# EAGLE board ACB-Light-R1.0-J05 (EAGLE 6.6.0)
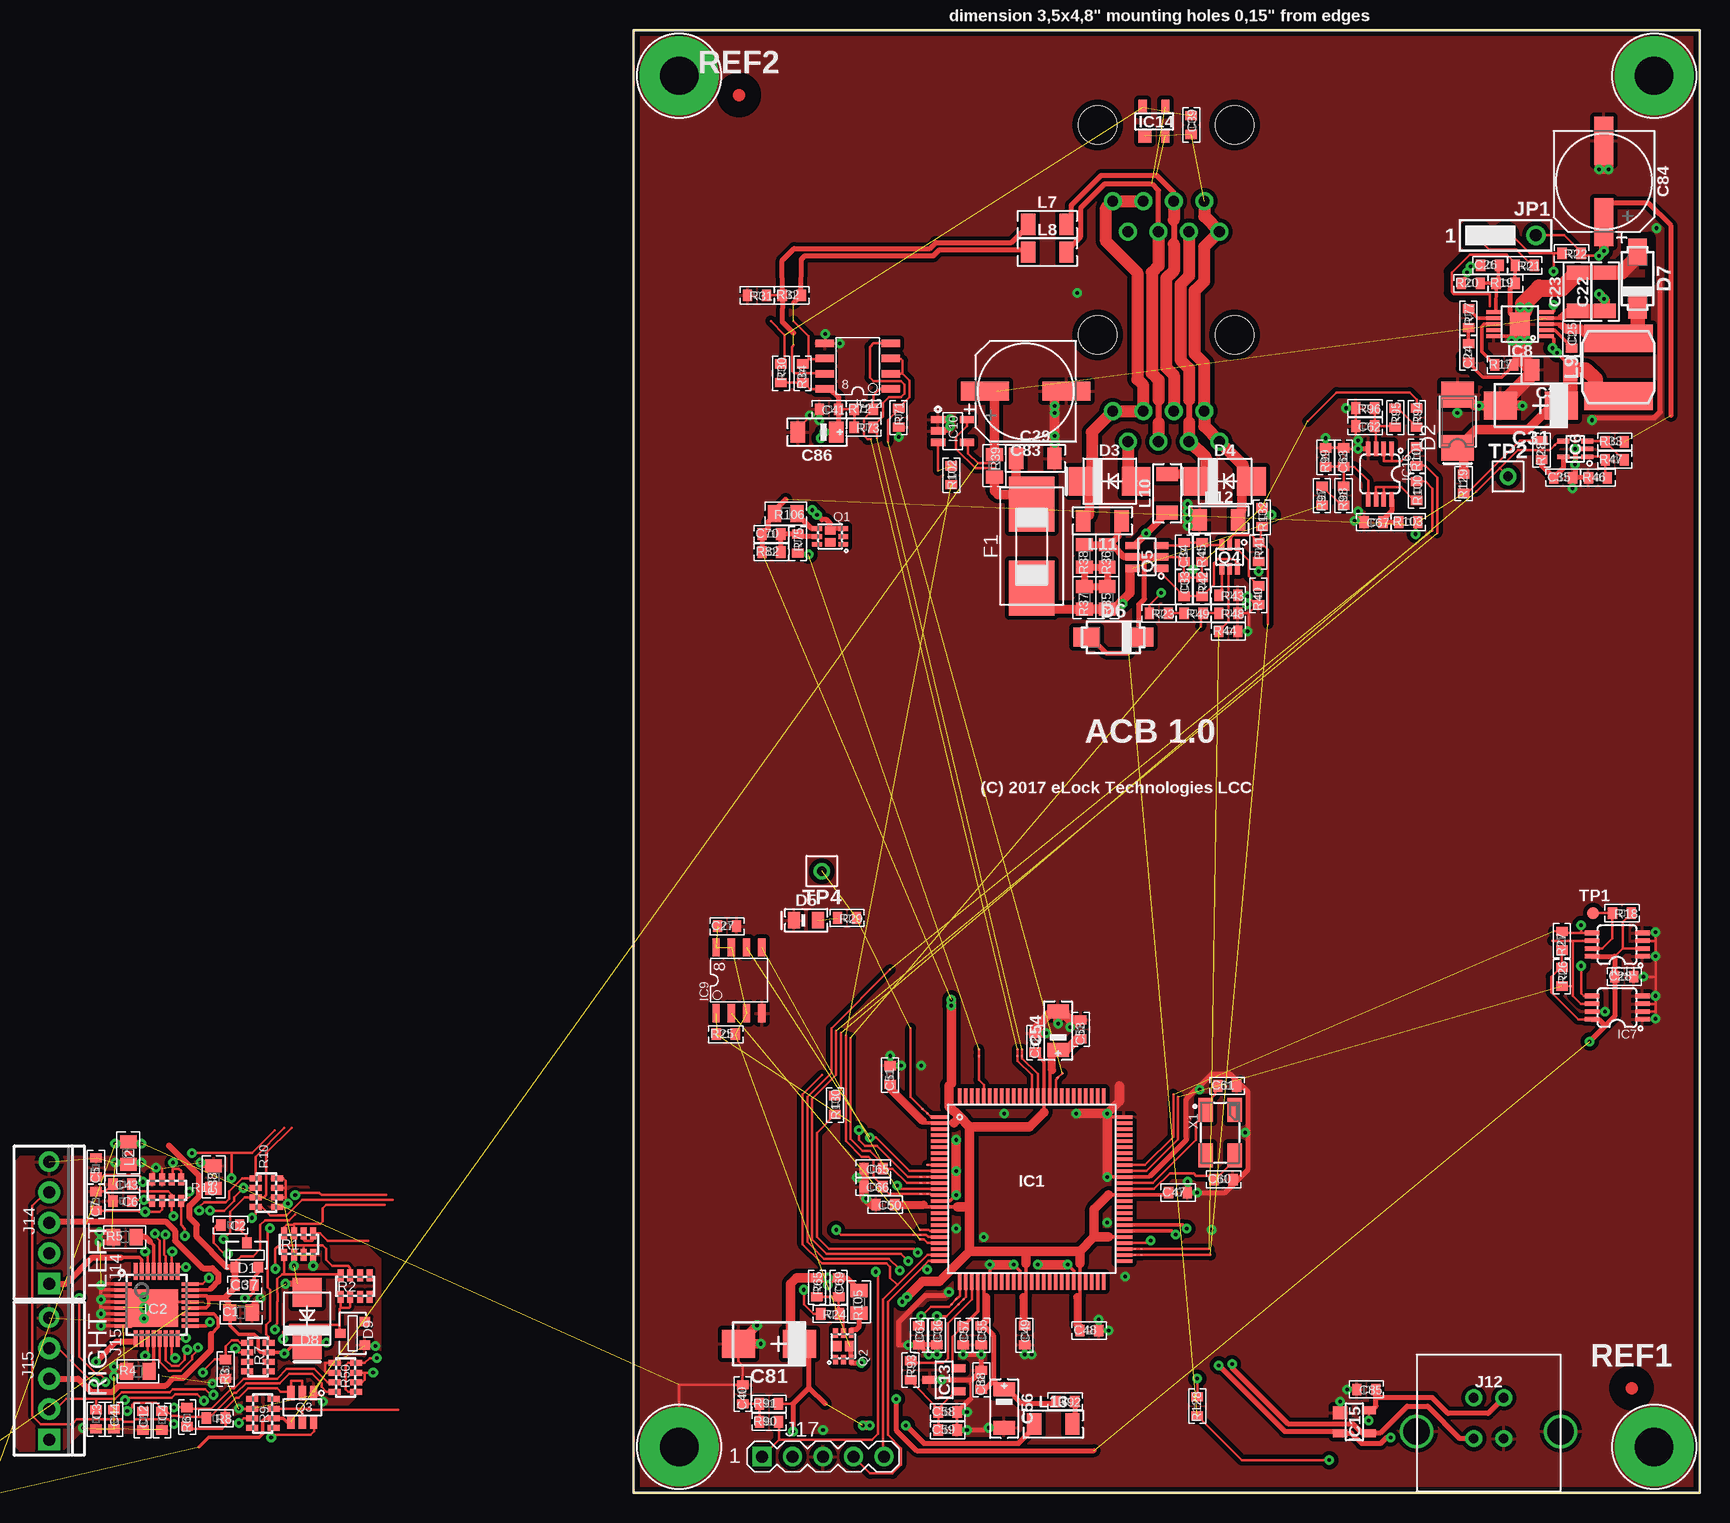
[diagram p6: board, top side]
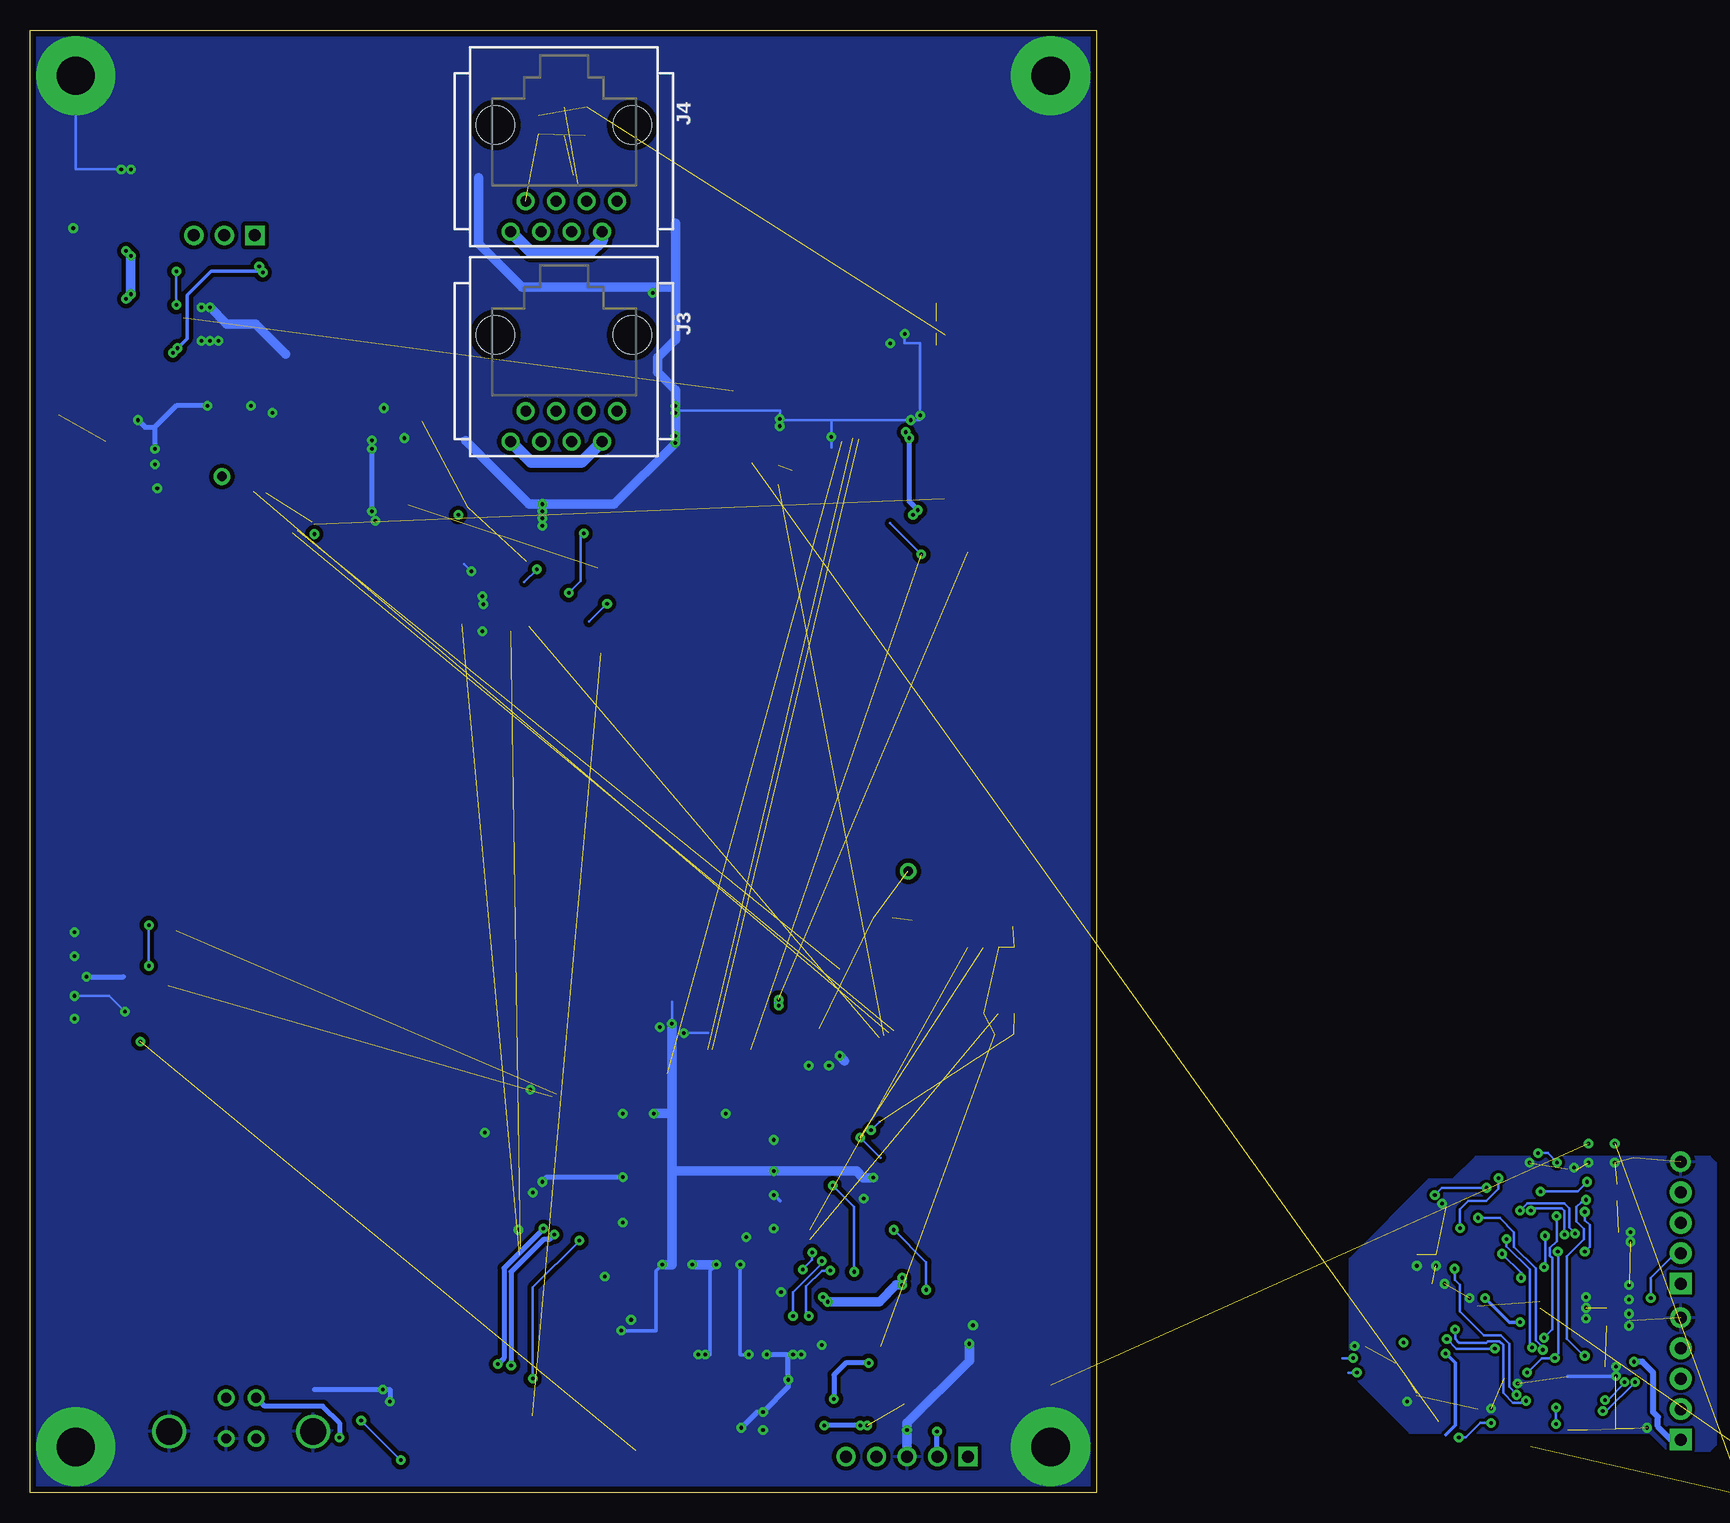
[diagram p7: board, bottom side, seen from below]

Size 88.9 x 121.92 mm. Coordinates in mm from the lower left corner, seen from the top.
Copper layers (1*16): Top 0.035mm / dielectric 1.5mm / Bottom 0.035mm
Design rules "default *": minimum track width 0.2mm, minimum drill 0.3mm, track to track 0.2mm, track to pad 0.2mm, pad to pad 0.2mm, via to via 0.2mm, smd to smd 0.001mm, copper to edge 0.5mm, drill to drill 0.2mm, minimum pad ring 0.3mm, minimum via ring 0.25mm, stop-mask expansion 0.1mm, vias tented up to drill 0.6mm, thermal gap 0.35mm
Net classes: 1 HV: clearance 0.3 mm to class 0
tRestrict: area -41.7,17.1 to -37.9,17.6; 34 lines

## Footprints (pad centres in the part's own frame; a part is rotated, then mirrored left to right if it is on the bottom)
0805 = smd 1.092 x 1.397: 1 -0.94,0; 2 0.94,0
0603 = smd 0.762 x 0.965: 1 -0.787,0; 2 0.787,0
1206 = smd 1.19 x 1.79: 1 -1.6,0; 2 1.6,0
CT-C = smd 2.743 x 2.311: + -2.54,0; - 2.54,0
1206-POL-C = smd 1.19 x 1.79: + -1.6,0; - 1.6,0
CAP_8MM_DIA_SMT = smd 1.59 x 3.99: 1 0,3.4; 2 0,-3.4
SOT-23 = smd 0.787 x 0.889: 1 0.991,1.016; 2 -0.94,1.016; 3 0.025,-1.016
SMA = smd 2.159 x 2.743: + -2.311,0.003; - 2.108,-0.002
SMB = smd 2.4 x 2.4: A 2.2,0; C -2.2,0
0805-POL-D = smd 0.99 x 1.39: A 1,0; K -1,0
SMA' = smd 2.21 x 1.575: A -2.223,0; K 2.223,0
LITTLEFUSE0154 = smd 4.6 x 3.8: 1 3.5,0; 2 -3.5,0
TQFP100_14X14_0,5MM = smd 1.39 x 0.28: 1 -7.7,6; 2 -7.7,5.5; 3 -7.7,5; 4 -7.7,4.5; 5 -7.7,4; 6 -7.7,3.5; 7 -7.7,3; 8 -7.7,2.5; 9 -7.7,2; 10 -7.7,1.5; 11 -7.7,1; 12 -7.7,0.5; 13 -7.7,0; 14 -7.7,-0.5; 15 -7.7,-1; 16 -7.7,-1.5; 17 -7.7,-2; 18 -7.7,-2.5; 19 -7.7,-3; 20 -7.7,-3.5; 21 -7.7,-4; 22 -7.7,-4.5; 23 -7.7,-5; 24 -7.7,-5.5; 25 -7.7,-6; 51 7.7,-6; 52 7.7,-5.5; 53 7.7,-5; 54 7.7,-4.5; 55 7.7,-4; 56 7.7,-3.5; 57 7.7,-3; 58 7.7,-2.5; 59 7.7,-2; 60 7.7,-1.5; 61 7.7,-1; 62 7.7,-0.5; 63 7.7,0; 64 7.7,0.5; 65 7.7,1; 66 7.7,1.5; 67 7.7,2; 68 7.7,2.5; 69 7.7,3; 70 7.7,3.5; 71 7.7,4; 72 7.7,4.5; 73 7.7,5; 74 7.7,5.5; 75 7.7,6 | smd 0.28 x 1.39: 26 -6,-7.7; 27 -5.5,-7.7; 28 -5,-7.7; 29 -4.5,-7.7; 30 -4,-7.7; 31 -3.5,-7.7; 32 -3,-7.7; 33 -2.5,-7.7; 34 -2,-7.7; 35 -1.5,-7.7; 36 -1,-7.7; 37 -0.5,-7.7; 38 0,-7.7; 39 0.5,-7.7; 40 1,-7.7; 41 1.5,-7.7; 42 2,-7.7; 43 2.5,-7.7; 44 3,-7.7; 45 3.5,-7.7; 46 4,-7.7; 47 4.5,-7.7; 48 5,-7.7; 49 5.5,-7.7; 50 6,-7.7; 76 6,7.7; 77 5.5,7.7; 78 5,7.7; 79 4.5,7.7; 80 4,7.7; 81 3.5,7.7; 82 3,7.7; 83 2.5,7.7; 84 2,7.7; 85 1.5,7.7; 86 1,7.7; 87 0.5,7.7; 88 0,7.7; 89 -0.5,7.7; 90 -1,7.7; 91 -1.5,7.7; 92 -2,7.7; 93 -2.5,7.7; 94 -3,7.7; 95 -3.5,7.7; 96 -4,7.7; 97 -4.5,7.7; 98 -5,7.7; 99 -5.5,7.7; 100 -6,7.7
SQFP-S-5X5-32 = smd 0.3 x 1.4: 1 -1.75,-2.8; 2 -1.25,-2.8; 3 -0.75,-2.8; 4 -0.25,-2.8; 5 0.25,-2.8; 6 0.75,-2.8; 7 1.25,-2.8; 8 1.75,-2.8; 17 1.75,2.8; 18 1.25,2.8; 19 0.75,2.8; 20 0.25,2.8; 21 -0.25,2.8; 22 -0.75,2.8; 23 -1.25,2.8; 24 -1.75,2.8 | smd 1.4 x 0.3: 9 2.8,-1.75; 10 2.8,-1.25; 11 2.8,-0.75; 12 2.8,-0.25; 13 2.8,0.25; 14 2.8,0.75; 15 2.8,1.25; 16 2.8,1.75; 25 -2.8,1.75; 26 -2.8,1.25; 27 -2.8,0.75; 28 -2.8,0.25; 29 -2.8,-0.25; 30 -2.8,-0.75; 31 -2.8,-1.25; 32 -2.8,-1.75 | smd 3.1 x 4.3: G 0.25,-0.35
SC-70-5 = smd 0.39 x 0.99: 1 -0.65,-1; 2 0,-1; 3 0.65,-1; 4 0.65,1; 5 -0.65,1
MSOP-08 = smd 0.38 x 1.2: 1 -1,-2.1; 2 -0.35,-2.1; 3 0.3,-2.1; 4 0.95,-2.1; 5 0.95,2.1; 6 0.3,2.1; 7 -0.35,2.1; 8 -1,2.1
MSOP10EXP = smd 0.3 x 1.2: 1 -1,-2.2; 2 -0.5,-2.2; 3 0,-2.2; 4 0.5,-2.2; 5 1,-2.2; 6 1,2.2; 7 0.5,2.2; 8 0,2.2; 9 -0.5,2.2; 10 -1,2.2 | smd 1.88 x 1.68: EP 0,0
SO-08 = smd 0.61 x 1.524: 1 -1.905,-2.743; 2 -0.635,-2.743; 3 0.635,-2.743; 4 1.905,-2.743; 5 1.905,2.743; 6 0.635,2.743; 7 -0.635,2.743; 8 -1.905,2.743
SOT23-5 = smd 0.6 x 1.2: 1 -0.95,-1.206; 2 0,-1.206; 3 0.95,-1.206; 4 0.95,1.206; 5 -0.95,1.206
SO08 = smd 0.61 x 1.524: 1 -1.905,-2.743; 2 -0.635,-2.743; 3 0.635,-2.743; 4 1.905,-2.743; 5 1.905,2.743; 6 0.635,2.743; 7 -0.635,2.743; 8 -1.905,2.743
SOT23 = smd 0.69 x 1.19: 1 0.95,1.2; 2 -0.95,1.2; 3 0,-1.2
SOT-143 = smd 1.09 x 1.19: 1 -0.75,-1.2 | smd 0.69 x 1.19: 2 0.95,-1.2; 3 0.95,1.2; 4 -0.95,1.2
RJ8-8-180 = drill 0.9 pad 1.4: 1 -4.445,6.35; 2 -3.175,8.89; 3 -1.905,6.35; 4 -0.635,8.89; 5 0.635,6.35; 6 1.905,8.89; 7 3.175,6.35; 8 4.445,8.89 | hole 3.2: 5.715,0; -5.715,0
USB_B_180 = drill 0.8 pad 1.4: 1_+5V 1.25,2.8; 2_D- -1.25,2.8; 3_D+ -1.25,-0.6; 4_GND 1.25,-0.6 | drill 2.2 pad 2.8: SH1 -6,0; SH2 6,0
3-641215-5 = drill 1 pad 1.829 square: 1 5.08,0 | drill 1 pad 1.829: 2 2.54,0; 3 0,0; 4 -2.54,0 | drill 1 pad 1.702: 5 -5.08,0
MA05-1 = drill 1 pad 1.6 square: 1 -5.08,0 | drill 1 pad 1.6: 2 -2.54,0; 3 0,0; 4 2.54,0; 5 5.08,0
JP3CLOSE12 = drill 1 pad 1.626 square: 1 -2.54,0 | drill 1 pad 1.626: 2 0,0; 3 2.54,0
0805-0RTOP = smd 1.092 x 1.397: 1 -0.94,0; 2 0.94,0
NR6028 = smd 2.3 x 5.7: 1 2.4,0; 2 -2.4,0
TEMP-PAD = smd 0.2 x 0.2: P$1 0,0
PCB-ACB = drill 3.2 pad 6.6: PAD_GND_1 3.81,118.11; PAD_GND_2 85.09,118.11; PAD_GND_3 3.81,3.81; PAD_GND_4 85.09,3.81
MICRO_FET = smd 0.4 x 0.8: 1 -0.65,-1.1; 2 0,-1.1; 3 0.65,-1.1; 4 0.65,1.1; 5 0,1.1; 6 -0.65,1.1 | smd 0.7 x 0.86: P1 -0.5,0; P2 0.5,0
SSOT-6 = smd 0.6 x 1.2: 1 -0.95,-1.2; 2 0,-1.2; 3 0.95,-1.206; 4 0.95,1.2; 5 0,1.2; 6 -0.95,1.2
SC70-6 = smd 0.39 x 0.99: 1 -0.65,-1; 2 0,-1; 3 0.65,-1; 4 0.65,1; 5 0,1; 6 -0.65,1
0603-ARRAY = smd 0.5 x 1: 1 -1.2,-0.9; 2 -0.4,-0.9; 3 0.4,-0.9; 4 1.2,-0.9; 5 1.2,0.9; 6 0.4,0.9; 7 -0.4,0.9; 8 -1.2,0.9
SMD_ROUND_1MM = smd 1 x 1: P$1 0,0
TH_ROUND_14MM08MM = drill 0.8 pad 1.4: P$1 0,0
7B = smd 2 x 1.2: 1 -1.9,-1.2; 2 1.9,-1.2; 3 1.9,1.2; 4 -1.9,1.2

## Placement (x,y rotation side)
C1  4.7u/16V  [0805]  -32.7,15 0 top  (outside the outline)
C2  10nF  [0603]  -33.6,22.3 180 top  (outside the outline)
C3  10nF  [0603]  -44.8,6.1 270 top  (outside the outline)
C4  10nF  [0603]  -39.3,6 270 top  (outside the outline)
C5  10nF  [0603]  -44.8,27.1 90 top  (outside the outline)
C6  10nF  [0603]  -42.6,24.3 180 top  (outside the outline)
C7  10nF  [0603]  -44.8,24.3 90 top  (outside the outline)
C8  100n  [0603]  -60.6,-6.9 0 top  (outside the outline)
C12  10nF  [0603]  -40.9,6 270 top  (outside the outline)
C22  4u7/50  [1206]  81,100.1 90 top
C23  4u7/50  [1206]  78.7,100.1 90 top
C24  1n  [0603]  69.6,95 90 top
C25  470n/25  [0603]  78.2,96.2 270 top
C26  10p  [0603]  71.4,102.3 0 top
C27  100n  [0603]  7.8,47.2 0 top
C28  100n  [0603]  82.6,43 0 top
C29  4u7/50  [1206]  33.5,86.2 0 top
C30  47u/6.3  [1206]  76.5,93.6 180 top
C31  47uTC  [CT-C]  74.8,90.6 180 top
C33  100n  [0603]  45.9,75.5 270 top
C34  1n  [0603]  45.9,78.4 90 top
C35  100n  [0603]  77.5,84.6 0 top
C36  100n  [0603]  25.3,13.1 270 top
C37  1u/16V  [0603]  -32.4,17.3 0 top  (outside the outline)
C38  4.7u/16V  [0805]  -35,26.3 90 top  (outside the outline)
C39  100n  [0603]  46.5,114 270 top
C40  100n  [0603]  9.1,8.2 90 top
C41  100n  [0603]  16.3,90.3 180 top
C43  10nF  [0603]  -42.6,25.7 180 top  (outside the outline)
C44  10nF  [0603]  -43.3,6.1 270 top  (outside the outline)
C47  100n  [0603]  45.4,25 0 top
C48  1u  [0603]  38,13.5 0 top
C49  100n  [0603]  32.6,13.1 270 top
C50  1u  [0603]  21,24 180 top
C51  100n  [0603]  21.4,34.8 90 top
C52  1u  [0603]  33.5,37.5 90 top
C53  10u  [0603]  37.3,38.6 90 top
C54  10uTA  [1206-POL-C]  35.4,38.5 90 top
C55  100n  [0603]  29,13.1 270 top
C56  10uTA  [1206-POL-C]  30.9,7 270 top
C57  100n->10n  [0603]  27.5,13.1 270 top
C58  100n  [0603]  26.2,6.7 0 top
C59  1u->100n  [0603]  26.2,5.2 0 top
C60  18p  [0603]  49.2,26.1 0 top
C61  18p  [0603]  49.5,33.9 0 top
C62  1n  [0603]  61,88.9 180 top
C63  1n  [0603]  59.2,86.3 90 top
C64  100n  [0603]  23.8,13.1 270 top
C65  1n  [0603]  20,27 180 top
C66  10n  [0603]  20,25.5 180 top
C67  10u  [0603]  61.7,80.9 180 top
C69  1n  [0603]  17.1,17.1 270 top
C70  1n  [0603]  11.5,79.9 0 top
C81  47uTC  [CT-C]  11.3,12.4 180 top
C83  220u/25V  [CAP_8MM_DIA_SMT]  32.7,91.8 90 top
C84  220u/25V  [CAP_8MM_DIA_SMT]  80.9,109.3 180 top
C85  100n  [0603]  61.1,8.6 180 top
C86  10uTA  [1206-POL-C]  15.3,88.4 180 top
C88  10u  [0603]  29,9.4 90 top
D1  BAT54S  [SOT-23]  -32.2,19.8 180 top  (outside the outline)
D2  SMLVT3V3  [SMA]  68.7,89.4 90 top
D3  P6SMB20A  [SMB]  39.7,84.3 0 top
D4  P6SMB20A  [SMB]  49.3,84.3 0 top
D5  LED-GREEN  [0805-POL-D]  14.4,47.7 0 top
D6  SS14  [SMA']  40,71.3 0 top
D7  SS14  [SMA']  83.7,101.2 270 top
D8  P6SMB16A  [SMB]  -27.2,14.5 90 top  (outside the outline)
D9  BZX84C6V2  [SOT-23]  -23.4,13.3 270 top  (outside the outline)
F1  T1A-LITTLEFUSE0154  [LITTLEFUSE0154]  33.2,78.9 90 top
IC1  PIC32MX470F512L-I/PF  [TQFP100_14X14_0,5MM]  33.2,25.3 0 top
IC2  L6227Q  [SQFP-S-5X5-32]  -39.74,15.63 270 top  (outside the outline)
IC6  MIC841LYC  [SC-70-5]  78.5,87 90 top
IC7  24LC32A-I/MS  [MSOP-08]  82,40.45 90 top
IC8  LT3971EMSE  [MSOP10EXP]  73.9,97.4 90 top
IC9  AT25SF321-SSHD  [SO-08]  8.8,42.7 0 top
IC10  MAX9938HEUK+T  [SOT23-5]  26.6,88.5 270 top
IC11  24LC32A-I/MS  [MSOP-08]  82,45.7 90 top
IC12  SN65HVD12D  [SO08]  18.7,93.9 90 top
IC13  REF3025  [SOT23]  25.9,9.4 270 top
IC14  TPD2E001DZDR  [SOT-143]  43.4,114.3 0 top
IC15  TPD2E001DZDR  [SOT-143]  60.1,5.9 270 top
IC16  MCP6042-I/MS  [MSOP-08]  62.2,84.9 180 top
J3  RJ8-8-180  [RJ8-8-180]  44.4,96.5 180 bottom
J4  RJ8-8-180  [RJ8-8-180]  44.4,114 180 bottom
J12  USB_A_180  [USB_B_180]  71.3,5.1 0 top
J14  3-641215-5  [3-641215-5]  -48.7,22.5 270 top  (outside the outline)
J15  3-641215-5  [3-641215-5]  -48.7,9.5 270 top  (outside the outline)
J17  DNP-open-hole  [MA05-1]  15.8,3 0 top
JP1  JP3CLOSE12  [JP3CLOSE12]  72.7,104.8 0 top
L2  DNP  [0805-0RTOP]  -42.1,28.3 90 top  (outside the outline)
L7  HI1206T500R  [1206]  34.5,105.7 0 top
L8  HI1206T500R  [1206]  34.5,103.4 0 top
L9  NR6028T4R7M  [NR6028]  82.1,93.8 90 top
L10  HI1206T500R  [1206]  44.5,83.3 90 top
L11  HI1206T500R  [1206]  39.1,81 180 top
L12  HI1206T500R  [1206]  48.8,81.1 0 top
L13  LQM31PN3R3M00L  [1206]  35,5.7 0 top
O1  PIC-OUT  [TEMP-PAD]  24.5,31.6 0 top
O5  PIC-RPX  [TEMP-PAD]  24.5,27.3 0 top
O6  PIC-RPX  [TEMP-PAD]  24.5,26.3 0 top
O7  PIC-RPX  [TEMP-PAD]  24.5,25.8 0 top
O8  PIC-RPX  [TEMP-PAD]  24.5,24.9 0 top
O12  PIC-RPX  [TEMP-PAD]  23.9,21.9 0 top
O13  PIC-RPX  [TEMP-PAD]  23.9,21.1 0 top
O15  PIC-RPX  [TEMP-PAD]  26.9,16.1 90 top
O16  PIC-RPX  [TEMP-PAD]  27.5,16.1 0 top
O23  PIC-OUT  [TEMP-PAD]  28.8,36.4 0 top
O29  PIC-RPX  [TEMP-PAD]  32,36.4 0 top
O30  PIC-RPX  [TEMP-PAD]  32.4,36.4 0 top
O31  PIC-OUT  [TEMP-PAD]  35.4,34.6 0 top
O41  PIC-RPX  [TEMP-PAD]  42.35,20.3 180 top
O42  PIC-RPX  [TEMP-PAD]  41.8,19.8 180 top
O44  PIC-OUT  [TEMP-PAD]  23.9,21.5 0 top
PCB1  PCB-ACB  [PCB-ACB]  0,0 0 top
Q1  SSM6P49NU,LFPZ  [MICRO_FET]  16.4,79.7 90 top
Q2  SSM6P49NU,LFPZ  [MICRO_FET]  17.5,12.2 0 top
Q3  FDC6330L  [SSOT-6]  -27.6,7.1 180 top  (outside the outline)
Q4  FDG6303N  [SC70-6]  49.7,78 180 top
Q5  FDC6506P  [SSOT-6]  42.8,78 90 top
Q6  FDG6303N  [SC70-6]  -57.6,-2.7 0 top  (outside the outline)
Q7  FDC6506P  [SSOT-6]  -60.7,-3 0 top  (outside the outline)
R1  100K  [0603-ARRAY]  -27.9,20.7 0 top  (outside the outline)
R2  33K  [0603-ARRAY]  -23.2,17.2 0 top  (outside the outline)
R3  300R  [0603]  -34,10.3 90 top  (outside the outline)
R4  0.12R  [0805]  -41.3,10.1 0 top  (outside the outline)
R5  0.12R  [0805]  -42.4,21.3 0 top  (outside the outline)
R6  649R  [0603]  -37.2,6.3 90 top  (outside the outline)
R7  3.3K  [0603-ARRAY]  -31.3,11.3 90 top  (outside the outline)
R8  649R  [0603]  -34.8,6.2 180 top  (outside the outline)
R9  100K  [0603-ARRAY]  -30.9,6.6 270 top  (outside the outline)
R10  1M  [0603-ARRAY]  -30.6,25 90 top  (outside the outline)
R11  10K  [0603-ARRAY]  -38.9,25.2 0 top  (outside the outline)
R12  1M  [0603]  -57.1,-6.9 0 top  (outside the outline)
R13  1M  [0603]  -60.6,-9.9 0 top  (outside the outline)
R14  300k  [0603]  -57.1,-9.9 0 top  (outside the outline)
R17  47k  [0603]  72.6,94 0 top
R18  10k  [0603]  82.4,48.3 180 top
R19  560k  [0603]  72.7,100.8 0 top
R20  1M  [0603]  69.8,100.8 0 top
R21  1M  [0603]  74.3,102.3 180 top
R22  4M99  [0603]  78.2,103.3 180 top
R23  1M  [0603]  43.8,73.3 180 top
R24  100k  [0603]  16.4,14.9 180 top
R25  1M  [0603]  7.7,38.2 0 top
R26  10k  [0603]  77.4,43 270 top
R27  10k  [0603]  77.4,46 90 top
R28  100R  [0603]  75.7,86.9 90 top
R29  300R  [0603]  17.8,47.9 180 top
R30  10k  [0603]  12.3,93.3 270 top
R31  1M  [0603]  10.3,99.8 180 top
R32  1M  [0603]  13.2,99.8 0 top
R33  4M99  [0603]  81.8,87.6 0 top
R34  1M  [0603]  14.1,93.3 90 top
R35  1k  [0805]  39.5,74.6 90 top
R36  1k  [0805]  39.5,78.1 90 top
R37  1k  [0805]  37.6,74.6 90 top
R38  1k  [0805]  37.6,78.1 90 top
R39  0.025R  [0805]  30.1,85.6 270 top
R40  300k  [0603]  52.1,74.8 90 top
R41  1M  [0603]  52.1,78.4 270 top
R42  1M  [0603]  47.4,75.5 270 top
R43  300k  [0603]  49.6,74.8 180 top
R44  1M  [0603]  49.6,71.8 0 top
R45  1M  [0603]  47.4,78.4 90 top
R46  560k->750k  [0603]  80.4,84.6 0 top
R47  100k->180k  [0603]  81.8,86.1 0 top
R48  1M  [0603]  49.6,73.3 180 top
R49  560k  [0603]  46.7,73.3 180 top
R50  100K  [0603-ARRAY]  -24,9.6 90 top  (outside the outline)
R65  1M  [0603]  15.3,17.1 270 top
R71  10k  [0603]  22.1,89.6 270 top
R72  1M  [0603]  19.2,90.3 0 top
R73  1M  [0603]  19.2,88.8 180 top
R75  100k  [0603]  13.7,79.1 270 top
R77  47k  [0603]  69.6,97.9 270 top
R82  1M  [0603]  11.5,78.4 0 top
R90  1k  [0603]  11.3,5.9 0 top
R91  10k  [0603]  11.3,7.4 0 top
R92  10R  [0603]  36,7.6 180 top
R93  300R  [0603]  23.1,10.2 270 top
R94  180k  [0603]  65.3,89.6 270 top
R95  4M99  [0603]  63.5,89.6 270 top
R96  560k  [0603]  61,90.4 180 top
R97  180k  [0603]  57.4,83.1 90 top
R98  4M99  [0603]  59.2,83.1 90 top
R99  560k  [0603]  57.7,86.3 90 top
R100  2k2  [0603]  65.3,83.5 270 top
R101  2k2  [0603]  65.3,86.4 90 top
R102  1k  [0603]  26.5,84.8 270 top
R103  300R  [0603]  64.6,80.9 0 top
R105  1R  [0805]  18.8,15.9 90 top
R106  1R  [0805]  12.7,81.6 180 top
R128  10k  [0603]  47,7.2 90 top
R129  DNP/0R  [0603]  69.2,84.1 90 top
R130  100k  [0603]  16.8,32.3 270 top
R132  1M  [0603]  52.4,81.3 270 top
REF1  REF  [REF]  83.2,8.7 0 top
REF2  REF  [REF]  8.8,116.5 0 top
T1  PIC-OUT  [TEMP-PAD]  -61.5,-12 0 top  (outside the outline)
T3  PIC-RPX  [TEMP-PAD]  23.95,25.8 180 top
T5  PIC-OUT  [TEMP-PAD]  42.35,19.8 180 top
T7  PIC-OUT  [TEMP-PAD]  41.8,20.3 180 top
T13  PIC-RPX  [TEMP-PAD]  32,36.95 0 top
T14  PIC-RPX  [TEMP-PAD]  32.4,36.95 270 top
T15  PIC-OUT  [TEMP-PAD]  35.75,34.95 270 top
T27  PIC-OUT  [TEMP-PAD]  23.95,26.3 270 top
T32  PIC-OUT  [TEMP-PAD]  23.35,21.5 270 top
T33  PIC-OUT  [TEMP-PAD]  28.8,36.95 270 top
T36  PIC-OUT  [TEMP-PAD]  24.1,32 0 top
T37  PIN-AN  [TEMP-PAD]  26.5,15.7 0 top
T38  PIN-AN  [TEMP-PAD]  27.1,15.7 270 top
T39  PIN-AN  [TEMP-PAD]  23.95,24.9 270 top
T45  PIC-RPX  [TEMP-PAD]  76.8,87.3 180 top
TP1  DNP-TestPoint  [SMD_ROUND_1MM]  80,48.3 0 top
TP2  DNP-TestPoint  [TH_ROUND_14MM08MM]  72.9,84.7 0 top
TP4  DNP-TestPoint  [TH_ROUND_14MM08MM]  15.7,51.8 180 top
X1  8MHz-5x3.2mm  [7B]  48.9,30 270 top

## Tracks (layer width: path | path; a pad name or v marks a point on that pad's centre or on a via)
+3,3V-FILT
  Top 0.4: R28.1 75.7,85.6 C35.1 77.5,85.4 IC6.5
+3.3V  (via drill 0.3 pad 0.7, 0.3 pad 0.8)  (4 unrouted)
  Top 0.2: R105.2 19,16.9 | 13.3,7.4 R91.2 | R129.1 69.3,83.4 69.6,83.4 73.9,87.7 R28.2 | R103.2 65.2,80.7 v65.2,79.9
  Top 0.28: C47.1 44.8,24.8 IC1.62 39.6,24.8 | 24.1,31 24.1,30.8 IC1.2 26.7,30.8 | 24.2,24 24.2,23.8 IC1.16 27,23.8 | 32.5,16.3 32.7,16.3 IC1.37 32.7,19.1 | 32.5,14.3 32.5,13.9 C49.1 | 37,16.3 37.2,16.3 IC1.46 37.2,19.1 | IC1.55 39.6,21.3 | C52.1 33.5,36.6 34.2,35.9 IC1.86 34.2,31.7
  Top 0.3: C69.1 17,17.9
  Top 0.4: R82.1 C70.1 11.2,80.4 11.2,80.9 11.7,81.4 R106.2 11.7,81.8 12.7,82.8 | v16.2,17.9 C69.1 17.8,17.9 R105.2 | 14.65,8.75 16,7.4 | v13.3,5.1 13.3,7.4 14.65,8.75 | 14.65,8.75 14.65,11.59 C81.+ | v22.7,5.6 24.2,4.1 32.1,4.1 33.4,5.4 L13.1
  Top 0.68: C51.1 21.4,33.7 24.1,31 | C50.1 24.2,24 | 32.5,16.3 32.5,14.3 | 37,16.3 37,14 37.2,13.8 C48.1
  Top 0.8: R28.2 75.6,87.7 | C81.+ 13.1,12.4 13.1,17.4 13.6,17.9 R65.1 v16.2,17.9 v16.2,17.3 | 27.2,31.3 26.3,32.2 26.3,33.9 26.5,34.1 v26.5,40.6 v26.5,41.1 | 26.7,30.8 27.2,31.3 | 27.2,31.3 28,30.5 | 28,30.5 28,23.8 | 28,23.8 28,20.1 | 28,20.1 25.5,17.6 24.1,17.6 v22.8,16.3 | 28,30.5 33,30.5 34.2,31.7 | 28,20.1 32.9,20.1 | 32.9,20.1 37.2,20.1 | 37.2,20.1 38.4,21.3 | 38.4,21.3 38.4,23.6 39.6,24.8 | 38.4,21.3 39.6,21.3 | 37.2,20.1 37.2,19.1 | 32.7,19.1 32.7,19.9 32.9,20.1 | 27,23.8 28,23.8 | 19.3,5.6 v19.1,5.6 v19.7,5.6
  Bottom 0.4: J17.2 13.3,3.04 v13.3,5.1 | v19.7,5.6 v22.7,5.6
  Bottom 0.8: v26.5,41.1 v26.5,40.6 | v22.8,16.3 v22.4,15.9 18.1,15.9 16.7,17.3 v16.2,17.3 v16.2,17.9
+3.3V/1  (via drill 0.3 pad 0.7, 0.3 pad 0.8)  (6 unrouted)
  Top 0.2: R26.1 77.4,43.9 | R27.1 77.4,43.9 | 77.4,43.9 76.5,43 76.5,41.7 78.75,39.45 IC7.8 | IC11.2 82.45,45.35 | 82.45,45.35 81.8,44.7 | R18.1 82.45,47.55 82.45,45.35 | 80.75,38.55 80.75,38.65
  Top 0.4: v21.9,7.8 21.9,5.2 23.6,3.5 38.4,3.5 | Q2.P2 18.15,12.2 Q2.3 18.15,10.8 v19,10.8 | IC11.8 81.8,44.7 C28.1 81.8,39.7 81,38.9 | 81,38.9 80.75,38.65 v79.7,37.6 | IC7.8 80.45,39.45 81,38.9
  Bottom 0.4: v19,10.8 20.9,10.8 21.9,9.8 v21.9,7.8
+3.3V/2  (via drill 0.3 pad 0.8)
  Top 0.2: C41.1 R72.1 R73.2 | R30.2 R34.1 14.2,92.5 14.71,92 IC12.8
  Top 0.3: 16.55,80.35 Q1.P2
  Top 0.4: Q1.3 16.55,80.35 | Q1.P2 16.4,80.8 16.1,81.1 15.7,81.1 v15.3,81.5 v14.9,81.9 | v15.6,87.9 15.6,88.1 v15.9,88.4 C86.+ 17.1,88.6 C41.1 17.1,91.3 16.41,92 IC12.8
  Bottom 0.4: v14.9,81.9 15.6,82.6 v15.6,87.9
/3.3V1PWRON  (via drill 0.3 pad 0.7)
  Top 0.2: v14.2,16.9 14.2,15.7 15,14.9 R24.2 | IC1.21 24.6,21.3 24.4,21.5 O44.P$1 T32.P$1 17.3,21.5 v16.9,21.9
  Bottom 0.2: v14.2,16.9 14.2,19.2 v16.9,21.9
/3.3V2PWRON  (via drill 0.3 pad 0.8)  (1 unrouted)
  Top 0.2: R75.2 13.8,78.2 v14.6,78.2 | IC1.96 29.2,34 28.8,34.4 O23.P$1 T33.P$1
  Bottom 0.2: v14.6,78.2 17.2,80.8
/FMEM1-CS  (via drill 0.3 pad 0.7)  (2 unrouted)
  Top 0.2: IC1.11 O6.P$1 T27.P$1 22.9,26.3 20.3,28.9 19.3,28.9 18.8,29.4 v18.8,30.2
  Bottom 0.2: 18.1,30.9 v18.8,30.2
/MCLR  (via drill 0.3 pad 0.7)
  Top 0.2: IC1.13 22.3,25.3 v22,25.6 | 12.12,4.4 19.9,4.4 20.4,4.9 20.4,18.2 v20.2,18.4 | 12.12,4.4 J17.1 | 12.12,4.4 12.12,5.88 R90.2
  Bottom 0.2: v20.2,18.4 20.2,23.8 v22,25.6
A+  (1 unrouted)
  Top 0.4: L8.2 36.1,103.5 37.3,104.7 37.3,107.1 39.3,109.1 43.2,109.1 43.77,108.53 J4.4
  Top 0.5: 43.77,91.1 43.77,89.17
  Top 1: J4.4 43.77,102.27 43.2,101.7 43.2,93.3 43.77,92.73 43.77,91.1 | 43.77,89.17 J3.4
A++  (1 unrouted)
  Top 0.2: R34.2 14.2,94.1 14.6,94.5 | 14.6,94.5 15.92,94.5 IC12.6 | 13.35,97.65 14.6,96.4 14.6,94.5
  Top 0.4: 13.35,99.15 R32.2 14,102.8 14.3,103.1 25,103.1 25.5,103.6 32.7,103.6 L8.1
ACT-L-SENSE
  Top 0.2: R1.8 -29.1,22.1 -28.9,22.3 -28.4,22.3 | -28.4,22.3 -28.3,22.4 -26.1,22.4 -25.9,22.6 -25.9,23.7 -25.6,24 -20.72,24 | R1.7 -28.3,22.2 -28.4,22.3
ACT-L-SW  (via drill 0.3 pad 0.7)
  Top 0.2: v-46.2,16.2 -46.2,11.3 -44.7,9.8 -44.4,9.8 -44,9.4 v-44,9.2 | R2.8 -24.5,18.2 -29.1,18.2 | -29.1,18.2 R1.1 | -29.1,18.2 -29.3,18.2 -29.7,17.8 -29.7,16.65 -29.65,16.6 -29.65,15.95 -29.7,15.9 -29.7,14.1 -29.9,13.9 v-29.9,13.6 | v-35.8,7.65 -36.35,8.2 -38.2,8.2 -38.5,7.9 -42.2,7.9 v-42.4,7.7 -42.6,7.7 -43.3,7 C44.1
  Bottom 0.2: J14.2 -48.26,19.96 -46.2,17.9 v-46.2,16.2 | v-42.4,7.7 -42.6,7.7 -44,9.1 v-44,9.2 | v-29.9,13.6 -29.9,12.8 -30.2,12.5 -32.5,12.5 -32.6,12.6 -32.62,12.6 -32.64,12.62 -33.58,12.62 -33.9,12.3 -33.9,8.3 -34.7,7.5 -35.65,7.5 v-35.8,7.65
ACT-R-SENSE
  Top 0.2: R1.6 -27.5,21.1 -27.4,21 -26.8,21 -26.7,21.1 R1.5 -26.1,21.6 -25.5,21 -22.1,21
ACT-R-SW  (via drill 0.3 pad 0.7)
  Top 0.2: J15.2 -48.14,6.96 -47.3,7.8 -44.8,7.8 | -27.5,20.6 -25.9,20.6 -25.6,20.3 -25.6,19.4 -25.1,18.9 -23.8,18.9 -23.6,18.7 R2.7 | -27.5,20.6 R1.3 | -27.5,20.6 -29.55,20.6 -29.85,20.3 v-29.85,18.65 | -44.8,7.8 -43.2,7.8 -42.65,8.35 -38.65,8.35 -38.4,8.6 -35.7,8.6 -35.3,8.2 -35.05,8.2 v-35,8.15 | C3.1 -44.8,7.8
  Bottom 0.2: v-29.85,18.65 -29.85,17.75 -30.3,17.3 -30.3,15.1 -32.3,13.1 -33.7,13.1 -34.4,12.4 -34.4,8.8 -35,8.2 v-35,8.15
ACT_EN  (via drill 0.3 pad 0.7)
  Top 0.2: -29.9,30.2 -31.8,28.3 -33.5,28.3 | -33.5,28.3 v-36.8,28.3 | -38.4,26.9 -38.4,26.2 R11.6 | v-38.4,27.5 -38.4,26.9 | R11.5 -37.7,26.8 -37.9,27 -38.3,27 -38.4,26.9 | v-30.3,22.05 -30.5,21.85 -30.5,17.1 -30.3,16.9 -30.3,14.3 -30.6,14 -30.6,13.2 -30.4,13 R7.4 | v-33.5,26.2 -33.5,28.3
  Bottom 0.2: v-36.8,28.3 -37.6,28.3 v-38.4,27.5 | v-30.3,22.05 -30.3,23.6 -31,24.3 -32.5,24.3 -33.5,25.3 v-33.5,26.2
ACT_L1  (via drill 0.3 pad 0.7)
  Top 0.2: IC2.27 -38.99,19.69 -39.1,19.8 -39.1,21.4 v-39,21.5 | v-36.2,23.5 -36.2,23.8 -35.8,24.2 -34,24.2 -33.7,24.5 -33.7,25.1 -32.6,26.2 R10.5 -31.5,28 -29.1,30.4
  Bottom 0.2: v-39,21.5 -39,23.5 -38.8,23.7 -36.4,23.7 v-36.2,23.5
ACT_L2  (via drill 0.3 pad 0.7)
  Top 0.2: IC2.28 -39.49,19.29 -39.5,19.3 -39.5,21 -39.9,21.4 v-39.9,21.6 | v-35.3,23.5 -34.1,23.5 -33.3,24.3 -33.3,24.6 v-32.5,25.4 R10.6 | -20.6,24.8 -26,24.8 -26.2,25 -28,25 v-28.2,24.8
  Bottom 0.2: v-39.9,21.6 -39.4,22.1 -39.4,23.7 -39,24.1 -36.46,24.1 -36.44,24.12 -35.92,24.12 v-35.3,23.5 | v-32.5,25.4 -28.8,25.4 v-28.2,24.8
ACT_L+
  Top 0.3: IC2.31 -40.99,19.39 -41.2,19.6 -42.7,19.6
  Top 0.5: -42.7,19.6 -45.1,19.6 -47.3,17.4 -48.68,17.4 J14.1
ACT_L-
  Top 0.3: IC2.23 -35.32,16.88 -35.2,17
  Top 0.5: -35.2,17 -34.6,17.6 -34.6,18.2 -35.1,18.7 -35.9,18.7 -38.2,21 -38.2,21.8 -39,22.6 -48.6,22.6 J14.3
ACT_R1  (via drill 0.3 pad 0.7)
  Top 0.2: IC2.13 -39.49,10.89 -38.75,10.15 -37.75,10.15 -36.8,11.1 -36.8,11.4 -36.3,11.9 v-36.3,12.1 | v-34.18,21.12 -33.6,21.7 -33.6,23.4 -32.4,24.6 R10.7 -30.8,24.6 -30.6,24.8 -30.6,28.3 -28.5,30.4
  Bottom 0.2: v-36.3,12.1 -36.1,12.3 -36.1,18.6 -34.18,20.52 v-34.18,21.12
ACT_R2  (via drill 0.3 pad 0.7)
  Top 0.2: IC2.14 -38.99,11.04 -38.5,10.55 -37.9,10.55 -37.4,11.05 -37.4,11.7 v-37.2,11.9 | v-31.8,22.9 -31.5,23.2 R10.8 -31,23.8 -30.3,23.1 -28.9,23.1 -27.6,24.4 -20.76,24.4 -20.74,24.42 -20.08,24.42
  Bottom 0.2: v-37.2,11.9 -37.2,12.1 -36.6,12.7 -36.6,18.7 -34.8,20.5 -34.8,21.7 -33.6,22.9 v-31.8,22.9
ACT_R+  (via drill 0.3 pad 0.7)
  Top 0.3: -41.6,12.6 -41.49,12.6 IC2.9
  Top 0.5: -41.6,12.6 -43.1,12.6 v-44.8,10.9
  Bottom 0.5: v-44.8,10.9 -45.5,10.9 -46.4,10 -46.4,6.7 -46.8,6.3 -46.8,5.5 -47.88,4.42 J15.1
ACT_R-
  Top 0.3: IC2.19 -34.98,14.88 -34.6,14.5 -34.6,13.8 -35.2,13.2
  Top 0.5: -35.2,13.2 -35.2,11.9 -37.55,9.55 -38.35,9.55 -39,8.9 -42.9,8.9 -43.4,8.4 -45.2,8.4 -46.3,9.5 J15.3
AVDD
  Top 0.28: IC1.30 29.2,16.3 29.4,16.3
  Top 0.4: C55.1 29.2,13.9 30,13.1 30,9.3 | 30,9.3 30.7,8.6 C56.+ 31.2,8.6 32.4,7.4 35.2,7.4 R92.2 | C88.1 29.3,8.6 30,9.3
  Top 0.6: 29.4,14.4 29.4,14.3 C55.1
  Top 0.68: 29.4,16.3 29.4,14.4
B-  (1 unrouted)
  Top 0.4: J3.5 45,90.11 | L7.2 36.1,106.1 36.5,106.5 36.5,107.3 39,109.8 43.6,109.8 45.03,108.36 J4.5
  Top 0.5: 45.03,106.1 45.03,104.1
  Top 1: J4.5 45.03,106.1 | 45.03,104.1 45.03,101.83 44.4,101.2 44.4,93.8 45.03,93.17 J3.5
B--  (1 unrouted)
  Top 0.2: 13.35,95.65 13.2,95.5 13.2,93.5 13.4,93.3 15.92,93.3 IC12.7 | R31.1 R32.1
  Top 0.4: 13.35,96.65 12.4,97.6 R32.1 12.4,102.7 13.4,103.7 24.7,103.7 25.2,104.2 31.5,104.2 32.5,105.2 32.5,105.3 L7.1
CURR-SENSE  (1 unrouted)
  Top 0.2: IC1.14 24.8,24.8 24.7,24.9 O8.P$1 T39.P$1 21.3,24.9 20.8,25.4 C66.1 20,26.3 20,27.6 19.6,28 19,28 17.7,29.3 17.7,38.1
D+  (via drill 0.3 pad 0.7, 0.3 pad 0.8)
  Top 0.28: IC1.57 45.8,22.3 v46.1,22
  Top 0.4: v49.9,10.7 49.9,10.4 54.6,5.7 60,5.7 60.75,4.95 IC15.3 62.25,4.95 64.5,7.2 66.2,7.2 68.9,4.5 J12.3_D+
  Bottom 0.4: v46.1,22 49.4,18.7 49.4,11.2 v49.9,10.7
D-  (via drill 0.3 pad 0.7, 0.3 pad 0.8)
  Top 0.28: IC1.56 44.9,21.8 v45.2,21.5
  Top 0.4: v48.8,10.6 54.3,5.1 58.5,5.1 58.65,4.95 IC15.2 59.85,4.95 60.7,4.1 62.3,4.1 62.8,4.6 v63.1,4.6
  Bottom 0.4: v45.2,21.5 45.6,21.1 46.1,21.1 48.8,18.4 v48.8,10.6 | J12.2_D- 69.35,7.2 64.5,7.2 63.1,5.8 v63.1,4.6
DGND  (via drill 0.3 pad 0.7, 0.3 pad 0.8)  (3 unrouted)
  Top 0.2: R96.2 C62.2 60.2,87.9 v60.4,87.7 v60.4,87 59.3,87 C63.2 R99.2 | C58.2 C59.2 | C28.2 v84.2,43 85.2,43 | 51.3,73.3 52,74 R40.1 51.9,74 v51.2,74.7 51.1,74.8 R43.1 | R71.2 v22.1,88 | v52.1,76.8 R41.2 | v15.5,89.4 C41.2 | C86.- 13.7,88.7 14.7,89.7 v14.7,89.8 | v16,96.6 16,95.85 IC12.5 17.09,95.81 17.1,95.8 v17.2,95.8 | R48.1 51.3,73.3 | R21.2 73.5,102.5 72.8,103.2 69.7,103.2 68.2,101.7 68.2,100.1 68.4,99.9 71.4,99.9 71.4,98.9 | C51.2 v22.3,35.6 | R44.2 v51.2,71.8 51.3,71.9 51.3,73.3 | C81.- 8.76,10.94 9.1,10.6 C40.2 3.81,9 PCB1.PAD_GND_3 | 28.1,7.8 28.1,9.3 28.2,9.4 | IC11.4 85.2,46.65 v85.2,46.7 85.2,46 | IC7.7 v81,40.1 | IC11.3 85.2,46 | 85.2,46 v85.2,44.7 | IC7.1 85.2,39.45 v85.2,39.5 85.2,40.1 | IC7.2 85.2,40.1 | IC7.3 85.2,40.75 | 85.2,40.75 85.2,40.1 | IC7.4 v85.2,41.4 | v85.2,41.4 85.2,40.75 | IC11.1 v85.2,44.7 | v85.2,44.7 85.2,43 | 85.2,43 v85.2,41.4 | v22.9,12.3 C64.2 | v51,30 51.2,30
  Top 0.28: IC1.45 36.7,18.5 v36.2,19 | v31.7,19 32.2,18.5 IC1.36 | IC1.31 v29.7,19 | IC1.15 26.4,24.3 v26.9,24.8 | IC1.75 39.8,31.3 v39.5,31.6 | C51.2 v21.4,36.4 | 43.1,26.4 43,26.3 IC1.65 v39.5,26.3
  Top 0.3: IC8.10 73.9,96.4 | R19.2 R21.2 | C24.1 70.8,93 72.4,93 R17.2 73.95,94.55 | v39.6,13.5 C48.2 v38.8,14.4
  Top 0.4: IC8.EP 73.9,97.5 73.1,98.3 73.1,100.4 R19.2 | v74.6,98.8 74.2,98.8 v73.9,98.8 | IC6.2 v78.5,87 v78.5,85.7 78.5,84.8 C35.2 R46.1 | IC16.4 v60.4,87 | v60.1,81 60.2,80.9 C67.2 60.4,81.4 v60.4,81.8 | IC10.2 26,88.5 v26.4,88.9 v26.4,89.5 26.35,89.45 IC10.1 | IC13.3 v25.7,9.4 28.2,9.4 C88.2 v29,11.5 | C59.2 v27.8,5.2 29.2,5.2 29.4,5.4 v29.6,5.4 C56.- | 50.3,34.3 51.2,33.4 51.2,30 51.2,26.9 50.2,25.9 | 43.1,26.4 46.1,29.4 46.1,32.8 46.9,33.6 v47.2,33.6 47.2,33.9 48.2,34.9 49.7,34.9 50.3,34.3 | 50.3,34.3 C61.2 | 50.2,25.9 49.3,25 v47,25 C47.2 v46.2,25.9 | 50.2,25.9 C60.2 | v79.9,89.4 80.1,89.6 85.1,89.6 85.6,90.1 85.6,101.05 | C49.2 v32.6,11.5 v33.2,11.5 | C57.2 27.5,11.6 | 27.5,11.6 v27.5,11.5 | C55.2 v29,11.5 | v29,11.5 27.6,11.5 27.5,11.6 | 28.1,7.8 C58.2 v27.8,6.7 | C85.2 v59.5,8.6 | v58.9,7.6 IC15.1 | v26.3,16.7 26,16.4 24.3,16.4 22.1,14.2 22.1,12.3 v22.9,12.3 | C64.2 v24.6,11.5 v25.3,11.5 C36.2 C64.2
  Top 0.5: -41.74,29.14 -41.76,29.14 -41.8,29.1 v-41,29.1 -42,29.1 | -42,29.1 v-43.2,29.1 | L2.2 -42,29.24 -42,29.1
  Top 0.8: v39.5,31.6 v36.9,31.6 | v73.2,96 v73.9,96 v74.6,96 | L12.1 47.2,81.5 46.2,81.5 v46.2,81.8 | v46.2,81.8 v46.2,81.2 v46.2,80.6 47.2,80.6 | v46.2,81.8 v46.2,82.4 | C29.2 v35.1,87.5 v35.1,88.1 v35.1,90 v35.1,90.6 35.1,91.8 C83.2 | v35.4,39.1 C54.- | v36.4,38.8 37,39.4 C53.2 36.4,39.4 35.7,40.1 C54.- | v34.4,38.3 C52.2 33.5,38.7 34.9,40.1 C54.- | 40.5,33.9 40.5,32.6 v39.5,31.6 | C31.- v70.48,90.6 70.1,90.6 69.8,90.9 69.31,90.9 D2.- | v31.7,19 v29.7,19 | v36.2,19 v33.7,19 | v39.5,26.3 v39.5,31.6 | v26.9,24.8 v26.9,26.8 v26.9,29.4 | C50.2 19.9,24 v19.4,24.5 19.2,24.7 C66.2 19.2,26.3 | 19.2,26.3 C65.2 | v18.6,26.25 19.15,26.25 19.2,26.3 | v10.3,13.94 C81.- v10.6,12.4 | v80.5,110.3 80.5,112.7 C84.2 81.3,112.7 v81.3,110.3 v80.5,110.3
  Top 0.813: v74.1,90.6 C31.-
  Top 1.2: 73.9,96.4 IC8.EP 73.9,97.9 74,98 arc90 74.1,98.1 74.1,98.5 74.2,98.5 | v73.9,96 73.9,94.6 73.95,94.55 C30.2 74.9,93.24 C31.- | 78.6,101.6 C23.2 C22.2 82.35,101.7 83.7,103.05 D7.A
  Top 1.4: 78.6,101.6 77.4,100.4 75.5,100.4 74.2,99.1 74.2,98.8 74.2,98.5
  Top 1.6: 73.9,96.4 v73.9,96
  Bottom 0.2: 52.7,77.4 v52.1,76.8 | v51.2,74.7 51.2,74.15 v51.1,74.05 | 22.1,89.4 26.4,89.4 v26.4,88.9 | 22.1,89.4 v15.5,89.4 14.7,89.4 v14.7,89.8 14.7,95.8 16,95.8 v16,96.6 | 22.1,89.4 v22.1,88 22.1,87.1 | v26.4,89.5 26.4,90.2 34.9,90.2 v35.1,90 | PCB1.PAD_GND_2 85.09,110.3 v81.3,110.3 | 32.4,38.3 v34.4,38.3 | 35.4,40.9 v35.4,39.1 | PCB1.PAD_GND_4 | v81,40.1 82.3,41.4 v85.2,41.4
  Bottom 0.28: v26.9,24.8 26.4,24.3 | v39.6,13.5 36.7,13.5 36.7,18.5 v36.2,19 | v32.6,11.5 32.2,11.5 32.2,18.5 v31.7,19 | v29,11.5 29.7,11.5 v29.7,19
  Bottom 0.4: v60.4,81.8 v60.4,87 | v74.1,90.6 76.7,90.6 78.5,88.8 | v25.3,11.5 25.7,11.5 | 25.7,11.5 v27.5,11.5 | 25.7,11.5 v25.7,9.4 25.7,8.8 v27.8,6.7 28.3,6.7 v29.6,5.4 | v58.9,7.6 58.9,8.6 v59.5,8.6 65.2,8.6 | v84.2,43 81.1,43 | 78.5,88.8 v78.5,87 | v79.9,89.4 79.3,88.8 78.5,88.8 | 85.09,3.7 PCB1.PAD_GND_4 | v46.2,25.9 45.8,26.3 v39.5,26.3
  Bottom 0.8: J17.3 15.8,5.8 10.6,11 v10.6,12.4 | 35.1,105.8 35.1,100.5 | 35.1,100.5 35.1,96.1 36.6,94.6 36.6,93.4 35.1,91.9 v35.1,90.6 v35.1,90 v35.1,88.1 v35.1,87.5 40.2,82.4 v46.2,82.4 47.3,82.4 52.6,87.7 | 51.5,109.6 51.5,104.1 47.9,100.5 35.1,100.5 | 35.4,31.6 v36.9,31.6 | 67.6,94.9 70.1,97.4 72.5,97.4 v73.9,98.8 | 35.4,31.6 35.4,26.8 | 35.4,26.8 35.4,19 v36.2,19 | v33.7,19 v31.7,19 | v18.6,26.25 19.45,26.25 20,26.8 v26.9,26.8 35.4,26.8 | 21,36 v21.4,36.4 | 35.4,31.6 v35.4,39.1
  other vias: 24,35.6 48.2,21.9 41,18 26.9,22 39.5,22.5 30.9,31.6 37,100 15.8,5.2 29.2,21.3 85.3,105.4 78.3,83.7 57.7,87.9 59.4,90.4 68.68,90
  pour Top (isolate 0.35): 0.5,0.5 88.5,0.5 88.5,121.5 0.5,121.5
  pour Bottom (isolate 0.35): 0.5,0.5 88.5,0.5 88.5,121.5 0.5,121.5
DGND-F  (2 unrouted)
  Top 0.8: L12.2 50.6,81.3 50.6,81.8 50.7,81.9 50.7,83.7 51.4,84.4
  Top 1: J4.7 47.58,106.38 J4.8 47.58,103.84 47.58,100.97 46.8,100.2 46.8,94.9 47.58,94.12 J3.7 47.58,88.88 J3.8 50.8,85.66 50.8,84.4 51.4,84.4 D4.A | J3.2 41.23,84.97 D3.A
  Bottom 1: J4.2 41.23,104.38 42.2,103.4 47.13,103.4 J4.8 | J3.2 42.94,85.9 47.13,85.9 J3.8
DOOR_L  (via drill 0.3 pad 0.7)
  Top 0.2: R50.2 -22.6,9.2 -22.4,9.4 -22.4,10 | R50.3 -22.4,10 | -22.4,10 v-21.7,10
  Bottom 0.2: v-21.7,10 -21,10
DOOR_L_SW  (via drill 0.3 pad 0.7)
  Top 0.2: J14.4 -48.96,25.04 -50.1,23.9 -50.1,6.4 -49.4,5.7 -46.8,5.7 -46.4,6.1 -42.7,6.1 -42.5,5.9 -41.7,5.9 -41.5,6.1 -40.9,6.1 | R50.7 -25.5,9.2 -26.6,10.3 -28.9,10.3 -29.7,9.5 -32.5,9.5 -33.3,8.7 -33.5,8.7 -35.2,7 -37.11,7 R6.2 -37.21,7.1 v-38.3,7.1 | -40.9,6.1 -38.8,6.1 -38.4,5.7 v-38.3,5.7 | C12.1 -40.9,6.1
  Bottom 0.2: v-38.3,5.7 v-38.3,7.1
DOOR_ON
  Top 0.2: R9.7 -27.6,7 | -27.6,7 -27.6,5.8 Q3.5 | -27.6,7 -27,7 -26.9,6.9 -19.6,6.9
DOOR_R  (via drill 0.3 pad 0.7)
  Top 0.2: R50.1 -23.8,8.4 -24,8.6 -24,10.6 -23.8,10.8 R50.4 -22.4,10.8 -22,11.2 v-21.4,11.2
  Bottom 0.2: v-21.4,11.2 -20.5,11.2
DOOR_R_SW  (via drill 0.3 pad 0.7)
  Top 0.2: J15.4 -47.94,12.04 -45.1,9.2 v-44.9,9.2 | R50.8 -25.6,8.4 -26,8.8 -26,9.1 -26.8,9.9 -28.7,9.9 -29.5,9.1 -32.3,9.1 -33.1,8.3 -33.3,8.3 -35.4,6.2 R8.2 -35.69,6.3 -37.8,6.3 -37.9,6.4 -38.5,6.4 -38.89,6.79 C4.1 -39.3,7 -39.8,7.5 -41.6,7.5 -41.8,7.3 -41.8,7.1 -42.1,6.8 v-42.2,6.8
  Bottom 0.2: v-44.9,9.2 -42.5,6.8 v-42.2,6.8
GATE-Q12A
  Top 0.2: Q5.1 44,76.6 C33.2 R42.2 48.4,75.7 48.4,77.5 48.7,77.8 50,77.8 50.35,77.45 Q4.6
GATE-Q12A1  (3 unrouted)
GATE-Q12B
  Top 0.2: Q5.3 45.65,78.95 C34.2 R45.2 47.6,79 Q4.3
LAN-CTL  (1 unrouted)
  Top 0.2: IC12.3 21.44,94.5 22.3,94.5 22.43,94.36 22.43,93.27 | IC1.84 35.2,34.4 O31.P$1 T15.P$1 | 21.2,87.6 21.2,89.4 21.8,90 21.8,90.4 R71.1 23,91.3 23,92.7 22.43,93.27 | 22.43,93.27 IC12.2
LAN-RX  (1 unrouted)
  Top 0.2: IC12.1 20.5,92 20,91.5 R72.2 19.2,89.5 19.2,88.1 19.5,87.8 19.8,87.8 | IC1.88 33.2,34.8 32,36 O29.P$1 T13.P$1
LAN-TX  (1 unrouted)
  Top 0.2: IC12.4 20,95.81 19.7,95.5 19.7,92.95 20,92.65 22.3,92.65 22.6,92.35 22.6,91.6 22.3,91.3 21.3,91.3 20.8,90.8 20.8,89.7 20,88.9 R73.1 20.3,88.5 20.3,87.9 | IC1.87 33.7,34.9 32.4,36.2 O30.P$1 T14.P$1
LED-PIC  (2 unrouted)
  Top 0.2: IC1.1 24.8,31.3 O1.P$1 T36.P$1 23.1,33 23.1,38.7
N$1  (via drill 0.3 pad 0.7)
  Top 0.2: IC2.25 -37.99,18.79 -38,18.8 v-37.3,18.8 | v-37.4,21.4 -37.4,22 -37.7,22.3 R11.4 -37.4,24.3 -37,24.7 v-37,25.1 | C5.1 -44.29,26.31 -44.1,26.5 -41.2,26.5 -40.9,26.2 v-40.9,25.9
  Bottom 0.2: v-37.3,18.8 -37.4,18.9 v-37.4,21.4 | v-37,25.1 -40.1,25.1 v-40.9,25.9
N$2  (via drill 0.3 pad 0.7)
  Top 0.2: IC2.16 -37.37,12.83 v-37.3,12.9 | v-38.35,23.05 -38.35,23.35 -38.5,23.5 R11.3 -38.5,24.8 -38.8,25.1 -41.1,25.1 -41.7,25.7 C43.1
  Bottom 0.2: v-37.3,12.9 -38,13.6 -38,19.55 -37.8,19.75 -37.8,20.4 -38.35,20.95 v-38.35,23.05
N$3  (via drill 0.3 pad 0.7)
  Top 0.2: IC2.11 -40.49,11.61 v-40.7,11.4 | R11.1 -40.2,24.2 -40.6,24.2 v-40.8,24.4 -41.5,24.4 -41.6,24.3 C6.1
  Bottom 0.2: v-40.7,11.4 -40.6,11.4 -39.2,12.8 -39.2,19.7 -40.6,21.1 -40.6,22 -40,22.6 -40,23.8 -40.4,24.2 -40.6,24.2 v-40.8,24.4
N$4  (1 unrouted)
N$6  (via drill 0.3 pad 0.7)
  Top 0.2: IC2.24 -35.92,17.38 v-35.4,17.9 | v-33.8,19.9 -34.1,19.9 -35,20.8 -35,22 -34.7,22.3 C2.2
  Bottom 0.2: v-35.4,17.9 -35.4,18.3 v-33.8,19.9
N$13
  Top 0.2: IC11.7 80.75,45.35 81.6,46.2 R18.2 TP1.P$1
N$14  (1 unrouted)
N$16
  Top 0.2: Q4.1 50.35,78.65 51.3,77.7 51.3,76.4 R40.2
N$17
  Top 0.2: R43.2 49.05,75.05 Q4.4
N$18  (2 unrouted)
  Top 0.2: 11.45,97.65 12.6,96.5 12.6,94.3 12.3,94.3 R30.1
N$19
  Top 0.2: C2.1 -32.81,21.91 -32.3,21.4 -32.3,20.89 D1.3
N$20
  Top 0.6: R38.1 R37.2 R35.2 R36.1 R38.1
N$21
  Top 0.2: R39.2 30.1,85.4 28.5,85.4 26.9,87 26.9,88 27.81,88.91 IC10.5
  Top 0.8: C29.1 31.9,83.2 | 31.9,83.2 32.7,82.4 F1.1 | 31.9,83.2 30.4,83.2 30.1,83.5 R39.2
N$24
  Top 0.4: R92.1 36.8,5.9 L13.2
N$27
  Top 0.2: IC6.1 80.75,86.35 R47.1 81,84.8 R46.2
N$28
  Top 0.2: R47.2 82.5,86.1 R33.1 80.95,87.65 IC6.3
N$29  (via drill 0.3 pad 0.7)
  Top 0.2: R7.6 -32.9,11.7 v-33.2,12 | v-29.2,12.8 -29.2,13.4 -28.6,14 -24.5,14 | -24.5,14 -24.5,13.36 D9.3 | R2.2 -23.6,15.5 -23.7,15.4 -24.4,15.4 | -24.4,15.4 -24.5,15.3 -24.5,14 | -24.4,15.4 R2.1
  Bottom 0.2: v-33.2,12 -30,12 v-29.2,12.8
N$31
  Top 0.3: IC2.12 -39.99,10.21 -40.1,10.1 R4.2
N$32
  Top 0.2: IC1.64 43.3,25.8 46.9,29.4 46.9,30.8 47.7,31.6 X1.1 48,32.2 48,32.7 48.5,33.2 48.5,33.7 C61.1
N$35  (via drill 0.3 pad 0.7)
  Top 0.2: R9.3 -32.5,6.2 v-32.9,5.8 | v-30.2,4.6 -30,4.8 -26.9,4.8 -26.6,5.1 -26.6,5.74 Q3.6
  Bottom 0.2: v-32.9,5.8 -32,5.8 -30.8,4.6 v-30.2,4.6
N$36
  Top 0.4: Q1.4 14.85,80.35 14.1,81.1 13.8,81.1 13.8,81.5 R106.1
N$38  (via drill 0.3 pad 0.7)  (1 unrouted)
  Top 0.2: 40.65,74.25 v40.8,74.1
  Top 0.6: Q5.6 41.45,77.05 41.4,77 41.4,76.9
  Top 0.8: 41.4,76.9 41.4,75 40.65,74.25 40,73.6 R35.1 R37.1 34.7,73.6 33.2,75.1 F1.2
  Bottom 0.2: v40.8,74.1 42.3,72.6
N$39
  Top 0.2: IC1.63 43.4,25.3 44.7,26.6 46.7,26.6 46.9,26.4 48.7,26.4 | X1.3 50.1,27.7 48.8,26.4 48.7,26.4 | 48.7,26.4 C60.1
N$40
  Top 0.2: R6.1 -37,5.3 -34.3,5.3 -34,5.6 -34,6.19 R8.1 -34.01,6.99 -33.1,7.9 -32.9,7.9 -32.1,8.7 -29.7,8.7 -29.4,8.4 -28.56,8.4 Q3.3 -28.55,9.3 -27.6,9.3 Q3.2
N$41
  Top 0.3: IC2.29 -39.99,20.59 -40.3,20.9
  Top 0.5: -40.3,20.9 -40.7,21.3 R5.2
N$44
  Top 0.2: C59.1 C58.1 25.4,7 | R93.2 23.1,9.3 25.4,7 | IC13.1 26.85,8.45 25.4,7
N$47  (via drill 0.3 pad 0.7)
  Top 0.3: IC2.17 -35.62,13.88 v-35.3,14.2 | v-32.4,16.2 -32.2,16.2 -31.7,16.7 -31.7,17.21 C37.2 -31.61,17.99 -31.3,18.3 -31.3,18.74 D1.2
  Bottom 0.3: v-35.3,14.2 -34.4,14.2 v-32.4,16.2
N$48
  Top 0.2: R95.1 63.7,90.4 R94.2
N$49
  Top 0.2: R95.2 63.5,88.9 C62.1 | C62.1 R96.1 | IC16.3 61.9,88.9 C62.1
N$50
  Top 0.3: R19.1 71.9,98.4 IC8.6 | R20.2 R19.1 | R19.1 72,100.8 72.1,100.9 72.1,102.2 C26.2
N$51
  Top 0.3: R77.2 C24.2
N$52
  Top 0.3: IC8.3 77.2,97.4 77.3,97.3
  Top 0.5: 77.8,97 77.5,97.3 77.3,97.3 77.7,96.9
  Top 0.8: 77.8,97 C25.1 79,97 79.8,96.2 L9.1
  Top 1.2: L9.1 83.2,96.2 83.7,96.7 D7.K
N$53
  Top 0.3: IC8.8 70.9,97.4 70.7,97.2 70.7,95.1 R17.1
N$54
  Top 0.3: IC8.7 70.4,97.9 R77.1
N$55  (via drill 0.3 pad 0.8)
  Top 0.2: R22.2 76.7,103.3 | 76.7,103.3 v76.7,101.8 | 76.7,103.3 74.7,103.3 73.2,104.8 JP1.2
  Top 0.3: IC8.5 76.6,98.4 76.7,98.5 v76.7,99
  Bottom 0.2: v76.7,99 v76.7,101.8
N$56
  Top 0.4: R105.1 18.8,13.8 18.6,13.6 18.15,13.6 Q2.4
N$57
  Top 0.3: IC8.2 76.8,96.9 78.1,95.6 78.2,95.5 C25.2
N$60
  Top 0.2: R98.1 59,82.3 R97.2
N$62
  Top 0.2: R49.2 R23.1
N$63
  Top 0.2: C63.1 R99.1 | C63.1 R98.2 | IC16.5 61.25,84.35 60.1,85.5 C63.1
N$64
  Top 0.2: IC16.7 62.55,83.8 | 62.55,83.8 61.9,83.8 IC16.6 | R100.2 65.1,82.7 64,83.8 62.55,83.8
N$65
  Top 0.4: IC16.8 63.2,81.8 62.6,81.2 62.6,81 C67.1 R103.1
N$66
  Top 0.2: IC16.1 63.2,86 | 63.2,86 62.55,86 IC16.2 | R101.2 65.2,87.2 64,86 63.2,86
N$67
  Top 0.2: R65.2 C69.2 17.1,15 R24.1 17.5,14.6 Q2.5
N$68  (1 unrouted)
  Top 0.2: IC10.3 25.39,85.21
N$70
  Top 0.2: R90.1 R91.1 C40.1
N$71  (via drill 0.3 pad 0.7)
  Top 0.2: IC2.30 -40.49,19.89 v-40.7,20.1 | R11.2 -39.3,23.6 -39.5,23.4 v-40.7,23.4 -41.2,23.4 -41.3,23.5 -44.79,23.5 C7.1
  Bottom 0.2: v-40.7,20.1 -41.1,20.5 -41.1,22.3 -40.7,22.7 v-40.7,23.4
N$73
  Top 0.4: Q1.5 13.9,79.7 R75.1 C70.2 R82.2
N$78  (via drill 0.3 pad 0.7)
  Top 0.2: IC2.26 -38.49,20.09 -38.48,20.1 v-38.45,20.1 | v-38.2,11.2 -38.5,11.5 IC2.15 | R7.5 -32.8,12.5 -33,12.7 -33.5,12.7 -34,12.2 -34,11.2 -33.9,11.1 | v-35.9,10 -35.9,10.1 -34.9,11.1 R3.2 | R3.2 -33.9,11.1 | -33.9,11.1 -33.81,11.1 | R3.2
  Bottom 0.2: v-38.45,20.1 -38.5,20.05 -38.5,11.6 -38.2,11.3 v-38.2,11.2 -37.1,11.2 v-35.9,10
N$85  (via drill 0.3 pad 0.8)  (1 unrouted)
  Top 0.2: IC15.4 v61.3,6 | v58,2.7 50.7,2.7 R128.1
  Top 0.4: D6.A 38.1,71.3 39.4,70 41.3,70 | IC15.4 61.35,6.9 61.6,6.9 61.9,7.2 61.9,7.9 | 61.9,7.9 C85.1 | J12.1_+5V 71.25,6.6 67.9,6.6 66.6,7.9 61.9,7.9
  Bottom 0.2: v61.3,6 v58,2.7
N$87
  Top 0.2: R21.1 74.8,102.6 74.6,102.6 73.6,103.6 71.36,103.6 JP1.1
OUT+3.3V  (via drill 0.3 pad 0.8)
  Top 0.3: 76,96.4 IC8.1 76.5,96.4 76.7,96.2 76.7,95.5 v76.6,95.4 v77,95 78.1,93.9 C30.1 | R20.1 69,101 69.5,101.5 v69.5,101.7 69.5,101.9 v69.8,102.2 69.9,102.3 C26.1
  Top 0.8: D2.+ 70.21,88.6 74.54,88.6 76.54,90.6 C31.+ | D2.+ 68.59,87.09 | R129.2 69.2,87.09 D2.+
  Top 1.2: C31.+ 78.1,91.36 C30.1 79.4,93.6 80.2,92.8 80.2,91.6 80.4,91.4 L9.2
  Bottom 0.3: v69.5,101.7 69.6,101.8 73.8,101.8 75.8,99.8 75.8,96.2 v77,95
PGC
  Top 0.2: IC1.24 24.5,19.8 22,17.3 | 22,17.3 20.8,16.1 20.8,3.08 J17.5 | 22,17.3 21.4,17.9 21.4,18.8 21.1,19.1 15.7,19.1 14.1,20.7 14.1,33.2 15.7,34.8
PGD  (via drill 0.3 pad 0.8)
  Top 0.2: IC1.25 24.6,19.3 24.2,18.9 | J17.4 19.74,1.6 21.6,1.6 22.3,2.3 22.3,3.7 21.2,4.8 21.2,15.9 24.2,18.9 | 24.2,18.9 v24.5,18.6 | v23.7,20 23.4,20.3 16.3,20.3 15.3,21.3 15.3,30 R130.2
  Bottom 0.2: v24.5,18.6 23.7,19.4 v23.7,20
PGND  (via drill 0.3 pad 0.7)  (25 unrouted)
  Top 0.2: IC2.4 IC2.21 | R11.7 -39.3,27 -39.4,27.1 v-39.8,27.1 -40,26.9 -40,26.4 -40.1,26.4 R11.8 | R10.4 -29.2,26.2 -29,26 -29,25.4 | -29,25.4 -29,24.5 | -29,24.5 -29,24.1 | R10.1 -29.1,23.8 -29,23.9 -29,24.1 | R10.3 -29,25.4 | R10.2 -29.1,24.6 -29,24.5 | -29,24.1 v-28.8,24.1 | R1.2 v-28.3,18.9 | R1.4 v-26.7,18.9 | D9.1 -22.38,12.22 -22.4,12.2 v-21.5,12.2 | v-25.9,7.6 -25.9,7.9 -26.1,8.1 -26.65,8.1 Q3.1 | C7.2 -44.01,25.09 | R3.1 -34.69,9.51 v-35.1,9.1 | R9.2 v-32.9,7 | v-40.8,15.4 -40.78,15.38 IC2.G | v-40.8,16.3 v-40.8,15.4 | v-40.8,15.4 v-40.8,14.5 | -44.01,25.09 -43.99,25.09 -43.39,24.49 C6.2 | -44.01,25.09 C43.2 | R50.6 -25.6,10 -25.7,10.1 -25.7,10.8 R50.5
  Top 0.3: IC2.1 -44.4,17.38 v-44.4,17.3 -44.4,16.9 | IC2.8 -44.38,13.88 v-44.4,13.9 -44.4,14.3 | IC2.7 -44.32,14.38 -44.4,14.3 | -44.4,14.3 v-44.4,14.9 | v-44.4,14.9 -44.4,15.4 | -44.4,15.4 -44.4,15.8 | -44.4,15.8 v-44.4,16.1 -44.4,16.4 | -44.4,16.4 -44.4,16.9 | IC2.2 -44.38,16.88 -44.4,16.9 | IC2.3 -44.38,16.38 -44.4,16.4 | IC2.4 -44.32,15.88 -44.4,15.8 | IC2.5 -44.38,15.38 -44.4,15.4 | IC2.6 -44.38,14.88 v-44.4,14.9
  Top 0.4: C38.2 -35.84,27.24 v-36.1,27.5 | C1.2 -31.76,15.54 v-31.1,16.2
  Top 0.5: R5.1 -43.34,21.54 -43.5,21.7 v-44.5,21.7 v-44.5,20.9 -43.3,20.9 -43.3,21.3 | R4.1 -42.24,9.86 -42.4,9.7 v-43.3,9.7 v-43.3,10.5 -42.4,10.5 -42.3,10.4 | D8.A -27.3,16.7 -28,17.4 v-29,17.4 | L2.1 -42.1,27.3 -42.3,27.5 v-43.2,27.5 v-41,27.5
  Bottom 0.3: v-43.3,9.7 -39.3,9.7
  other vias: -45.9,5.4
  pour Bottom (isolate 0.254): -51.1,28 -31.6,28 -29.7,26.1 -27.7,26.1 -21.1,19.5 -21.1,10 -26.1,5 -46.1,5 -47.6,3.5 -51.1,3.5 -51.6,4 -51.6,27.5
  pour Top (isolate 0.254): -51.1,28 -31.6,28 -29.1,25.5 -27.1,25.5 -21.1,19.5 -21.1,10 -26.1,5 -46.1,5 -47.6,3.5 -51.1,3.5 -51.6,4 -51.6,27.5
POWER-GOOD  (1 unrouted)
  Top 0.2: R130.1 17.3,33.6 17.3,38.3 | IC6.4 77.5,87.6 77.1,87.6 76.85,87.35 T45.P$1 76.4,86.9 73.7,86.9 72.2,85.4 | 72.2,85.4 70.25,83.45 | TP2.P$1 72.2,85.4
REF2,5V
  Top 0.2: C57.1 26.6,13 26.6,10.5 26.75,10.35 IC13.2
  Top 0.28: IC1.29 28.7,15.1 C57.1
REF-EN
  Top 0.2: IC1.28 28.2,16.1 26.2,14.1 26.2,11.2 25.8,10.8 23.3,10.8 R93.1
SCL1-EEPROM  (1 unrouted)
  Top 0.2: 78.3,42.2 78.3,41.4 78.95,40.75 IC7.6 | 78.3,42.2 78.3,46 | R26.2 78.3,42.2 | IC1.66 42.75,26.8 45.4,29.45 45.4,33 | IC11.6 78.3,46 | 78.3,46 76.6,46
SCLK2-SPI  (via drill 0.3 pad 0.7)  (1 unrouted)
  Top 0.2: IC1.10 23,26.8 20.2,29.6 v19.7,29.6
  Bottom 0.2: 18,27.9 v19.7,29.6
SD-CS
  Top 0.2: IC1.9 O5.P$1
SDA1-EEPROM  (via drill 0.3 pad 0.7)  (1 unrouted)
  Top 0.2: v79,43.9 79,41.6 79.2,41.4 IC7.5 | 79.95,46.7 IC11.5 79,46.65 | IC1.67 42.65,27.3 45,29.65 45,33.2 | 76.7,46.8 R27.2 77.55,46.65 79,46.65 | v79,47.3 79,46.65
  Bottom 0.2: v79,43.9 v79,47.3
SDI2-MISO  (1 unrouted)
  Top 0.2: IC1.22 24.5,20.8 24.2,21.1 24,21.1 O13.P$1
SDO2-MOSI  (1 unrouted)
  Top 0.2: IC1.20 24.7,21.8 24.6,21.9 24.35,21.9 O12.P$1
VACT  (via drill 0.3 pad 0.7)  (1 unrouted)
  Top 0.2: -28.2,23.2 -28.7,22.7 -30.7,22.7 -31.1,22.3 -31.1,20.3 -31.7,19.7 -32.7,19.7 -33.1,19.3 -33.1,18.88 D1.1
  Top 0.3: IC2.22 -35.58,16.38 -35.4,16.2 -35.4,15.6 -35.62,15.38 IC2.20 | -33.6,14.97 -33.6,13.9 -32.9,13.2 -31.6,13.2 -31.3,12.9 -31.3,11.9 -31.1,11.7 R7.3 -29.1,11.7 | -29.1,11.7 -29,11.7 -28.2,12.5 -27.4,12.5 | -27.4,12.5 D8.C | -27.4,12.5 v-25.6,12.5 | v-29.1,11.6 -29.1,11.7
  Top 0.4: -33.77,15.87 -33.77,15.13 C1.1 -33.61,14.97 -33.6,14.97
  Top 0.5: -33.77,15.87 -34.1,16.2 | -34.1,16.2 -35.4,16.2 | -34.1,16.2 -33.19,17.11 C37.1 -33.2,17.31 | D1.1 -33.88,18.78 -36.4,21.3 -36.4,22.3 -37,22.9 -37,23.9 -36.2,24.7 -36.2,25.36 | -36.2,25.36 -36.2,26.4 -38.7,28.9 | -36.2,25.36 C38.1
  Top 0.6: C37.1 D1.1
  Bottom 0.3: -29.1,4.8 -29.9,5.6 -29.9,10.8 v-29.1,11.6
VACT-ON  (2 unrouted)
VBAT  (via drill 0.3 pad 0.8)  (6 unrouted)
  Top 0.2: R39.1 30.1,85.8 28.7,85.8 27.9,86.6 27.9,87.3 28.15,87.55 IC10.4 | JP1.3 77.6,104.8 79,103.4 R22.1 79.2,103.1 v80.5,103.1 | -28.79,5.79 Q3.4
  Top 0.3: IC8.4 77.2,97.9 77.3,98 | -36.2,3.8 -35.4,4.6 -31.2,4.6 -30.9,4.9 -30.9,6 -30.7,6.2 R9.6 -29.2,6.2 -28.79,5.79
  Top 0.4: 86.5,89.8 86.5,105.6 84.6,107.5 80.9,107.5 80.9,107.2 80.75,107.05
  Top 0.5: 78.5,98.3 C23.1 | 77.8,98.3 77.5,98 77.3,98 77.7,98.4
  Top 0.8: 77.8,98.3 78,98.3 78.2,98.5 C23.1 | v80.5,99.9 v80.9,99.5 81,99.4 C22.1 | 30.3,91.8 C83.1 30.1,91.8 R39.1 | v80.5,103.1 v80.9,103.5 C84.1 80.9,106.9 80.75,107.05
  Top 1.21: C23.1 C22.1
  Bottom 0.8: v80.9,99.5 v80.5,99.9 v80.5,103.1 v80.9,103.5
VBAT-LAN
  Top 0.8: D3.C 38,84.3 38,81.5 L11.2
  Top 1: J4.3 J4.1 39.4,107.09 39.4,104.3 41.99,101.7 41.99,92.81 42.49,92.31 J3.3 J3.1 38.2,88.39 38.2,84.9 37.6,84.3 D3.C
VBAT-LAN-F  (via drill 0.3 pad 0.7)  (2 unrouted)
  Top 0.2: R94.1 65.3,91.1 64.7,91.7 58.6,91.7 56.2,89.3 | C34.1 45.5,78 Q5.2 | C33.1 C34.1 | C33.1 R42.1 R45.1 | R45.1 47.5,77.6 | 47.3,76.3 v46.65,76.95 | v46.65,76.95 46,76.3 C33.1 | v46.65,76.95 46,77.6 C34.1 | v46.65,76.95 47.3,77.6 R45.1 | R132.1 53,81.5 v53.2,81.5
  Top 0.4: 42.4,78 42.6,77.8 42.6,74.5 42.1,74 42.1,71.8 42.22,71.68 D6.K | R42.1 47.3,76.3
  Top 0.6: Q5.2 42.4,78 Q5.5 40.9,78 40,78.9 39.7,78.9 R36.2 | R38.2 R36.2 | R36.2 39.8,79.1 40.4,79.7 40.4,80.3 40.8,80.7 40.8,81.1 L11.1
  Bottom 0.2: v46.65,76.95 47.7,75.9
VBAT-ON  (1 unrouted)
  Top 0.2: 52.3,79.2 R41.1 51.5,79.8 50,79.8 49.7,79.5 Q4.2 | 52.3,79.2 52.9,78.6 52.9,72.4 | 48.1,19.8 T5.P$1 O42.P$1 IC1.52 | 52.3,79.2 52.3,80.4 R132.2
VBAT-SENSE  (via drill 0.3 pad 0.7)  (1 unrouted)
  Top 0.2: R100.1 66,84.3 66.6,83.7 66.6,80.2 | v22.2,18.5 22.2,18.6 21.3,19.5 15.9,19.5 14.5,20.9 14.5,33 16.5,35 16.5,38.7 21.4,43.6 | IC1.26 27.2,16.4 O15.P$1 T37.P$1 26.3,15.5 24.8,15.5 v24,14.7 24,14.1 C64.1
  Bottom 0.2: v22.2,18.5 22.9,18.5 24.2,17.2 24.2,14.9 v24,14.7
VBATLAN-SENSE  (via drill 0.3 pad 0.7)  (1 unrouted)
  Top 0.2: v22.9,19.3 22.3,19.9 16.1,19.9 14.9,21.1 14.9,32.8 16.9,34.8 16.9,38.5 | R101.1 66,85.6 67,84.6 67,80 | IC1.27 27.7,16.3 O16.P$1 T38.P$1 26.1,14.7 v25.3,14.7 C36.1
  Bottom 0.2: v22.9,19.3 22.9,19.1 25.3,16.7 v25.3,14.7
VBUS  (via drill 0.3 pad 0.7, 0.3 pad 0.8)
  Top 0.2: IC1.54 42.9,20.8 v43.1,21 | v47,9.5 R128.2
  Bottom 0.2: v43.1,21 47,17.1 v47,9.5
VCAP
  Top 0.28: IC1.85 34.7,35.2 34.9,35.2
  Top 0.68: 34.9,35.2 34.9,36.9
  Top 0.8: 34.9,36.9 C54.+ 36.1,36.9 37,37.8 C53.1
VPS-ON  (1 unrouted)
  Top 0.2: Q4.5 49.7,76.6 49.6,76.5 49.6,72.6 R44.1 | 48,20.3 O41.P$1 T7.P$1 IC1.53
VPS-PWR
  Top 0.5: 46.3,91.1 46.3,89.2
  Top 0.6: 46.5,84.9 D4.C
  Top 0.8: L10.2 46.5,84.9
  Top 1: J4.6 46.3,101.41 45.6,100.7 45.6,94.4 46.3,93.69 46.3,91.1 | 46.3,89.2 J3.6 46.39,87.61 47.7,86.3 47.7,84.9 D4.C
VPS-PWR-F  (via drill 0.3 pad 0.7, 0.3 pad 0.8)
  Top 0.2: R23.2 43,74 v44,75
  Top 0.6: Q5.4 41.75,78.95 v42.75,79.95 L10.1
  Bottom 0.2: v44,75 43,76 43,79.7 v42.75,79.95
VPS-SENSE  (1 unrouted)
  Top 0.2: 18.1,37.9 18.1,29.5 19.1,28.5 19.7,28.5 20.8,27.4 C65.1 21.6,27 22.8,25.8 T3.P$1 O7.P$1 IC1.12 | R48.2 R49.1 47.3,73.1 47.3,72.2

## Text on the board
tPlace: ACB 1.0 | (C) 2017 eLock Technologies LCC | J14 | LEFT | J15 | RIGHT
Document: Left | Actuators | Right